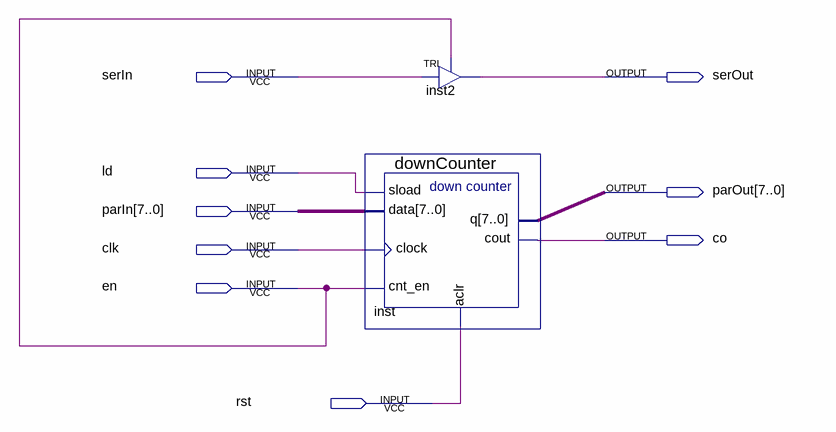
[diagram p0: schematic sheet]
// Quartus schematic transmitter.bdf as structural Verilog: 2 symbols, 9 pins
module transmitter (
  input  serIn,
  input  ld,
  input  [7:0] parIn,
  input  clk,
  input  en,
  input  rst,
  output serOut,
  output [7:0] parOut,
  output co
);

  downCounter inst (.sload(ld), .data(parIn), .clock(clk), .cnt_en(en), .aclr(rst), .cout(co), .q(parOut));
  TRI inst2 (.IN(serIn), .OE(en), .OUT(serOut));
endmodule
